# EAGLE design Music Shield v2.0 (EAGLE 6.2)
music shield

## Sheet 1 of 2
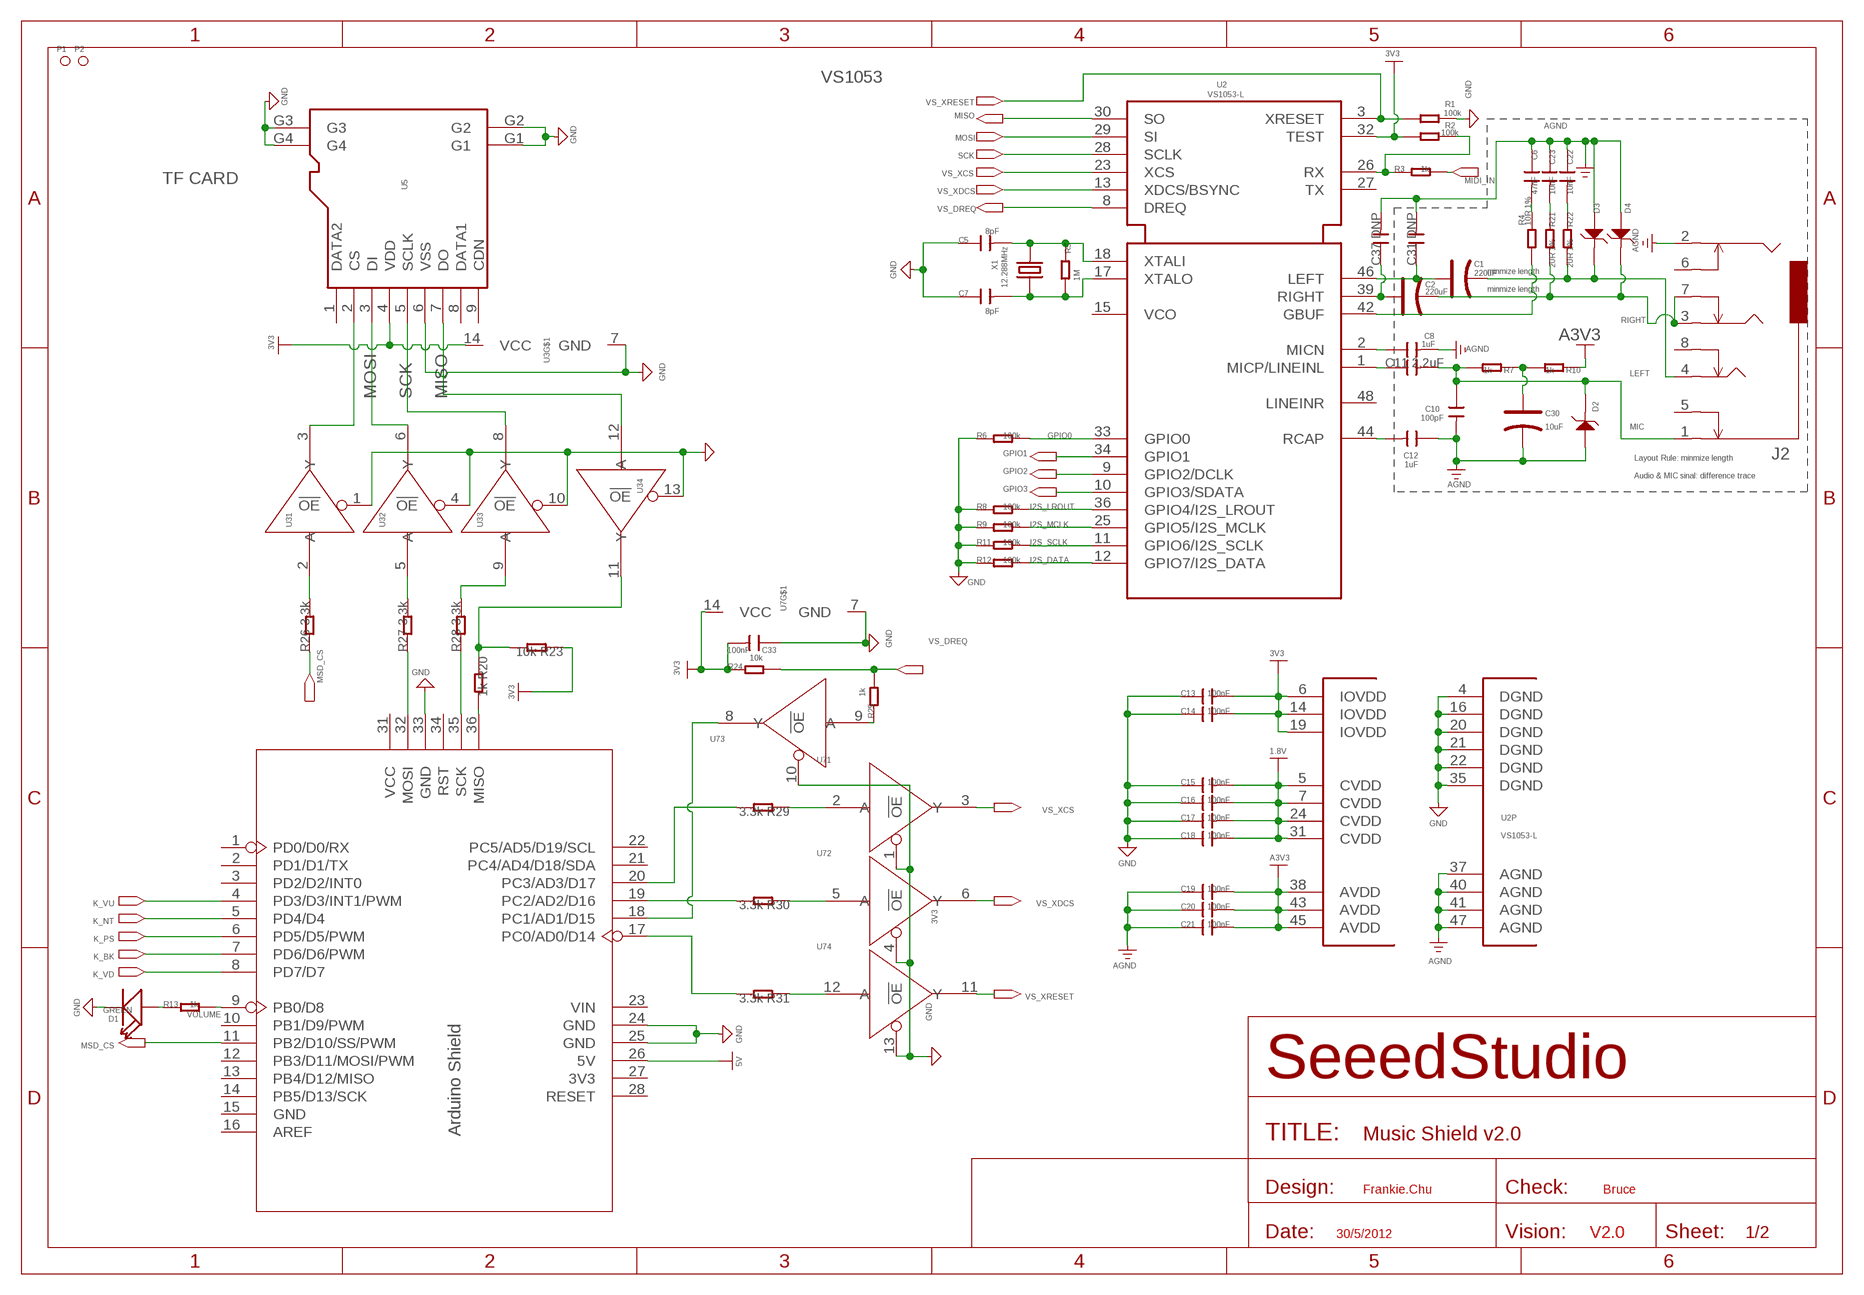
[diagram p0: schematic, sheet 1]

### Parts
C1  220uF  CAP-AVX-B  [AVX-B]
C2  220uF  CAP-AVX-B  [AVX-B]
C5  8pF  C-0603  [C0603]
C6  47nF  C-0603  [C0603]
C7  8pF  C-0603  [C0603]
C8  1uF  C-0603  [C0603]
C10  100pF  C-0603  [C0603]
C11  2.2uF  C-0805  [C0805]
C12  1uF  C-0603  [C0603]
C13  100nF  C-0603  [C0603]
C14  100nF  C-0603  [C0603]
C15  100nF  C-0603  [C0603]
C16  100nF  C-0603  [C0603]
C17  100nF  C-0603  [C0603]
C18  100nF  C-0603  [C0603]
C19  100nF  C-0603  [C0603]
C20  100nF  C-0603  [C0603]
C21  100nF  C-0603  [C0603]
C22  10nF  C-0603  [C0603]
C23  10nF  C-0603  [C0603]
C30  10uF  CAP-AVX-A  [AVX-A]
C31  DNP  C-0603  [C0603]
C33  100nF  C-0603  [C0603]
C37  DNP  C-0603  [C0603]
D1  GREEN  LED'0603'  [LED-0603]
D2  CESD5V0D1  D-ESD  [SOD123-2.7X1.6]
D3  CESD5V0D1  D-ESD  [SOD123-2.7X1.6]
D4  CESD5V0D1  D-ESD  [SOD123-2.7X1.6]
J2  AUDIO-8P'PJ-3536-L6S'  [8P-3.5-SMD]
P1  PAD-MARK  [ROUND-MARK-1.0]
P2  PAD-MARK  [ROUND-MARK-1.0]
R1  100k  R-0603  [R0603]
R2  100k  R-0603  [R0603]
R3  1k  R-0603  [R0603]
R4  10R 1%  R-0603  [R0603]
R5  1M  R-0603  [R0603]
R6  100k  R-0603  [R0603]
R7  1k  R-0603  [R0603]
R8  100k  R-0603  [R0603]
R9  100k  R-0603  [R0603]
R10  1k  R-0603  [R0603]
R11  100k  R-0603  [R0603]
R12  100k  R-0603  [R0603]
R13  1k  R-0603  [R0603]
R20  1k  R-0603  [R0603]
R21  20R 1%  R-0603  [R0603]
R22  20R 1%  R-0603  [R0603]
R23  10k  R-0603  [R0603]
R24  10k  R-0603  [R0603]
R25  1k  R-0603  [R0603]
R26  3.3k  R-0603  [R0603]
R27  3.3k  R-0603  [R0603]
R28  3.3k  R-0603  [R0603]
R29  3.3k  R-0603  [R0603]
R30  3.3k  R-0603  [R0603]
R31  3.3k  R-0603  [R0603]
U2  VS1053-L  [LQFP48]
U3  74VHC125PW  [TSSOP14]
U5  HOLDER-MICROSD-9P  [9P-SMD-W/-RING]
U7  74VHC125PW  [TSSOP14]
U9  ARDUINO  [ARDUINO]
X1  12.288MHz  CRYSTAL'5032'  [2P-SMD-5X3.2]

### Nets
1.8V: C15.2 C16.2 C17.2 C18.2 U2.5(CVDD) U2.7(CVDD) U2.24(CVDD) U2.31(CVDD) ; supply symbol labelled POWER_BAR ; also sheet 2
3V3: C13.2 C14.2 C33.2 R2.1 R23.1 R24.1 U2.6(IOVDD) U2.14(IOVDD) U2.19(IOVDD) U2.32(TEST) U3.14(VCC) U5.4(VDD) U7.14(VCC) ; supply symbol labelled POWER_BAR ; also sheet 2
5V: U9.26(5V) ; supply symbol labelled POWER_BAR ; also sheet 2
A3V3: C19.2 C20.2 C21.2 R10.1 U2.38(AVDD) U2.43(AVDD) U2.45(AVDD) ; supply symbol labelled POWER_BAR ; also sheet 2
AGND: C6.1 C8.2 C10.2 C12.1 C19.1 C20.1 C21.1 C22.1 C23.1 C30.- C31.2 C37.2 D2.1 D3.1 D4.1 J2.2 U2.37(AGND) U2.40(AGND) U2.41(AGND) U2.47(AGND) ; also sheet 2
GND: C5.1 C7.1 C13.1 C14.1 C15.1 C16.1 C17.1 C18.1 C33.1 D1.- R1.2 R6.1 R8.1 R9.1 R11.1 R12.1 U2.4(DGND) U2.16(DGND) U2.20(DGND) U2.21(DGND) U2.22(DGND) U2.35(DGND) U3.1(1:!OE) U3.4(2:!OE) U3.7(GND) U3.10(3:!OE) U3.13(4:!OE) U5.6(VSS) U5.G1 U5.G2 U5.G3 U5.G4 U7.1(1:!OE) U7.4(2:!OE) U7.7(GND) U7.10(3:!OE) U7.13(4:!OE) U9.24(GND) U9.25(GND) U9.33(GND) ; supply symbol labelled GND_SIGNAL ; also sheet 2
GPIO0: R6.2 U2.33(GPIO0)
GPIO1: U2.34(GPIO1) ; also sheet 2
GPIO2: U2.9(GPIO2/DCLK) ; also sheet 2
GPIO3: U2.10(GPIO3/SDATA) ; also sheet 2
I2S_DATA: R12.2 U2.12(GPIO7/I2S_DATA) ; also sheet 2
I2S_LROUT: R8.2 U2.36(GPIO4/I2S_LROUT) ; also sheet 2
I2S_MCLK: R9.2 U2.25(GPIO5/I2S_MCLK) ; also sheet 2
I2S_SCLK: R11.2 U2.11(GPIO6/I2S_SCLK) ; also sheet 2
K_BK: U9.7(PD6/D6/PWM) ; also sheet 2
K_NT: U9.5(PD4/D4) ; also sheet 2
K_PS: U9.6(PD5/D5/PWM) ; also sheet 2
K_VD: U9.8(PD7/D7) ; also sheet 2
K_VU: U9.4(PD3/D3/INT1/PWM) ; also sheet 2
LEFT: C1.- D3.2 J2.4 R22.2
MIC: C10.1 C11.2 D2.2 J2.1 R7.2
MIDI_IN: R3.2 ; also sheet 2
MISO: U2.30(SO) U3.12(4:A) U5.7(DO)
MOSI: U2.29(SI) U3.6(2:Y) U5.3(DI)
MSD_CS: R26.1 U9.11(PB2/D10/SS/PWM)
N$1: C5.2 R5.1 U2.18(XTALI) X1.2
N$2: C7.2 R5.2 U2.17(XTALO) X1.1
N$3: C12.2 U2.44(RCAP)
N$4: C30.+ R7.1 R10.2
N$5: C22.2 R22.1
N$6: C2.+ C37.1 U2.39(RIGHT)
N$7: C8.1 U2.2(MICN)
N$8: C1.+ C31.1 U2.46(LEFT)
N$9: C6.2 R4.2
N$10: C23.2 R21.1
N$11: C11.1 U2.1(MICP/LINEINL)
N$12: R2.2 R3.1 U2.26(RX)
N$14: R31.2 U9.17(PC0/AD0/D14)
N$15: R4.1 U2.42(GBUF)
N$16: R26.2 U3.2(1:A)
N$17: R29.1 U7.2(1:A)
N$18: R27.2 U3.5(2:A)
N$19: R30.1 U7.5(2:A)
N$20: R31.1 U7.12(4:A)
N$21: U3.3(1:Y) U5.2(CS)
N$22: R29.2 U9.20(PC3/AD3/D17)
N$23: R30.2 U9.19(PC2/AD2/D16)
N$24: U7.8(3:Y) U9.18(PC1/AD1/D15)
N$26: R27.1 U9.32(MOSI)
N$33: R28.1 U9.35(SCK)
N$36: R20.2 U9.36(MISO)
N$37: D1.+ R13.1
N$38: R25.1 U7.9(3:A)
N$39: R20.1 R23.2 U3.11(4:Y)
N$40: R28.2 U3.9(3:A)
RIGHT: C2.- D4.2 J2.3 J2.7 R21.2
SCK: U2.28(SCLK) U3.8(3:Y) U5.5(SCLK)
VOLUME: R13.2 U9.9(PB0/D8)
VS_DREQ: R24.2 R25.2 U2.8(DREQ)
VS_XCS: U2.23(XCS) U7.3(1:Y)
VS_XDCS: U2.13(XDCS/BSYNC) U7.6(2:Y)
VS_XRESET: R1.1 U2.3(XRESET) U7.11(4:Y)
Unconnected: J2.5 J2.6 J2.8 U2.15(VCO) U2.27(TX) U2.48(LINEINR) U5.1(DATA2) U5.8(DATA1) U5.9(CDN) U9.1(PD0/D0/RX) U9.2(PD1/D1/TX) U9.3(PD2/D2/INT0) U9.10(PB1/D9/PWM) U9.12(PB3/D11/MOSI/PWM) U9.13(PB4/D12/MISO) U9.14(PB5/D13/SCK) U9.15(GND) U9.16(AREF) U9.21(PC4/AD4/D18/SDA) U9.22(PC5/AD5/D19/SCL) U9.23(VIN) U9.27(3V3) U9.28(RESET) U9.31(VCC) U9.34(RST)

### Notes on the sheet
- VS1053
- TF CARD
- minmize length
- minmize length
- Layout Rule: minmize length
- Audio & MIC sinal: difference trace
- Arduino Shield
- Frankie.Chu | Bruce
- 30/5/2012 | V2.0

## Sheet 2 of 2
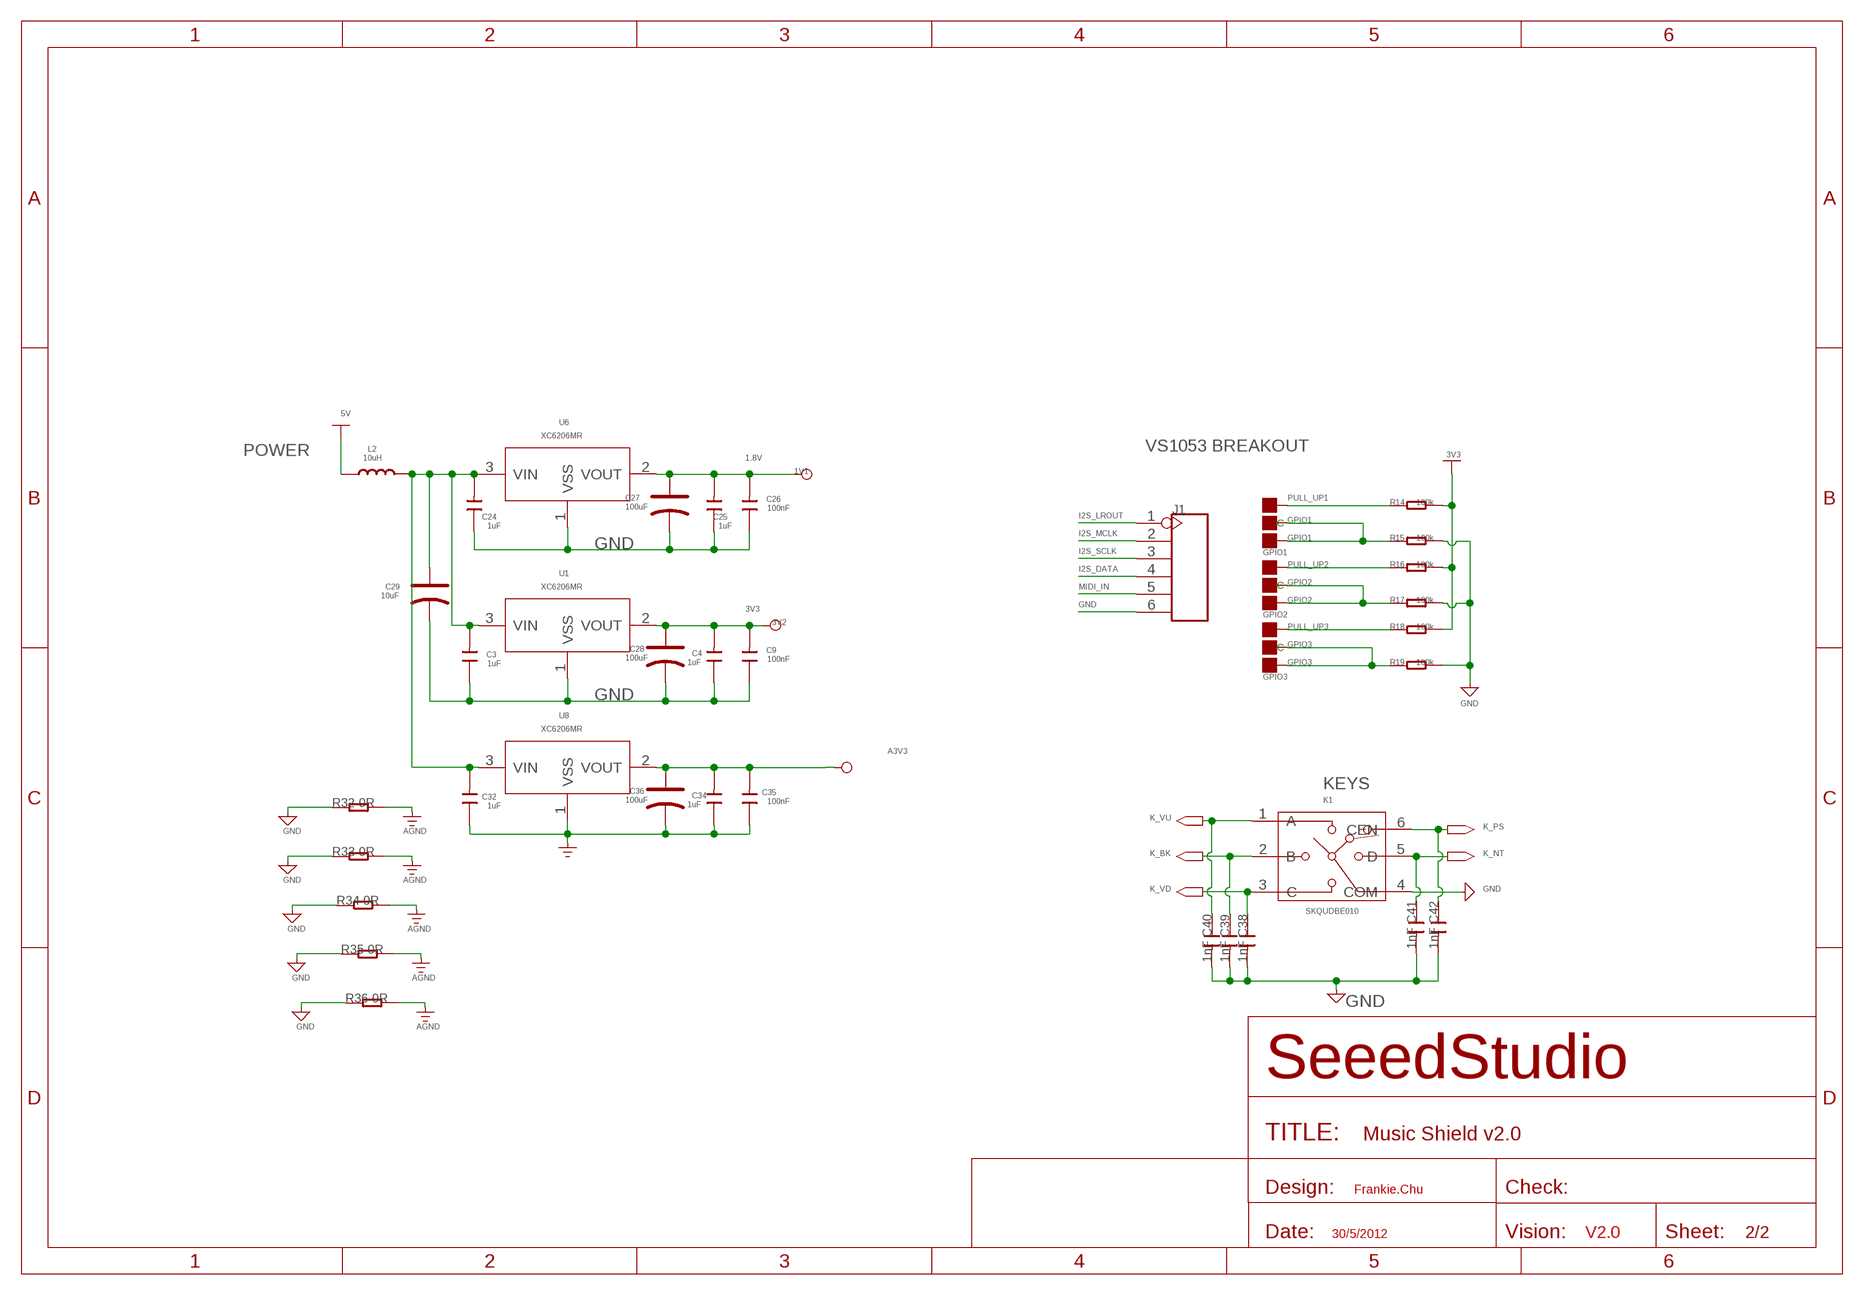
[diagram p1: schematic, sheet 2]

### Parts
1V1  TEST_POINT_SIZE_3030  [TP_3535]
3V2  TEST_POINT_SIZE_3030  [TP_3535]
A3V3  TEST_POINT_SIZE_3030  [TP_3535]
C3  1uF  C-0603  [C0603]
C4  1uF  C-0603  [C0603]
C9  100nF  C-0603  [C0603]
C24  1uF  C-0603  [C0603]
C25  1uF  C-0603  [C0603]
C26  100nF  C-0603  [C0603]
C27  100uF  CAP-AVX-B  [AVX-B]
C28  100uF  CAP-AVX-B  [AVX-B]
C29  10uF  CAP-AVX-A  [AVX-A]
C32  1uF  C-0603  [C0603]
C34  1uF  C-0603  [C0603]
C35  100nF  C-0603  [C0603]
C36  100uF  CAP-AVX-B  [AVX-B]
C38  1nF  C-0603  [C0603]
C39  1nF  C-0603  [C0603]
C40  1nF  C-0603  [C0603]
C41  1nF  C-0603  [C0603]
C42  1nF  C-0603  [C0603]
GPIO1  PAD-JUMPER-3P-40*40  [3P-SMD-4.1X1.5]
GPIO2  PAD-JUMPER-3P-40*40  [3P-SMD-4.1X1.5]
GPIO3  PAD-JUMPER-3P-40*40  [3P-SMD-4.1X1.5]
J1  HEADER-6P-55/35MIL  [6P-2.54-55/35MIL]
K1  SKQUDBE010  [6P-10X10X8.6MM]
L2  10uH  L'0806'  [0806]
R14  100k  R-0603  [R0603]
R15  100k  R-0603  [R0603]
R16  100k  R-0603  [R0603]
R17  100k  R-0603  [R0603]
R18  100k  R-0603  [R0603]
R19  100k  R-0603  [R0603]
R32  0R  R-0603  [R0603]
R33  0R  R-0603  [R0603]
R34  0R  R-0603  [R0603]
R35  0R  R-0603  [R0603]
R36  0R  R-0603  [R0603]
U1  XC6206MR  [SOT23]
U6  XC6206MR  [SOT23]
U8  XC6206MR  [SOT23]

### Nets
1.8V: 1V1.T C25.2 C26.2 C27.+ U6.2(VOUT) ; also sheet 1
3V3: 3V2.T C4.2 C9.2 C28.+ R14.2 R16.2 R18.2 U1.2(VOUT) ; supply symbol labelled POWER_BAR ; also sheet 1
5V: L2.1 ; supply symbol labelled POWER_BAR ; also sheet 1
A3V3: A3V3.T C34.2 C35.2 C36.+ U8.2(VOUT) ; also sheet 1
AGND: C32.1 C34.1 C35.1 C36.- R32.2 R33.2 R34.2 R35.2 R36.2 U8.1(VSS) ; also sheet 1
GND: C3.1 C4.1 C9.1 C24.1 C25.1 C26.1 C27.- C28.- C29.- C38.2 C39.2 C40.2 C41.2 C42.2 J1.6 K1.4(COM) R15.2 R17.2 R19.2 R32.1 R33.1 R34.1 R35.1 R36.1 U1.1(VSS) U6.1(VSS) ; supply symbol labelled GND_SIGNAL ; also sheet 1
GPIO1: GPIO1.00(L) GPIO1.MM(C) R15.1 ; also sheet 1
GPIO2: GPIO2.00(L) GPIO2.MM(C) R17.1 ; also sheet 1
GPIO3: GPIO3.00(L) GPIO3.MM(C) R19.1 ; also sheet 1
I2S_DATA: J1.4 ; also sheet 1
I2S_LROUT: J1.1 ; also sheet 1
I2S_MCLK: J1.2 ; also sheet 1
I2S_SCLK: J1.3 ; also sheet 1
K_BK: C39.1 K1.2(B) ; also sheet 1
K_NT: C41.1 K1.5(D) ; also sheet 1
K_PS: C42.1 K1.6(CEN) ; also sheet 1
K_VD: C38.1 K1.3(C) ; also sheet 1
K_VU: C40.1 K1.1(A) ; also sheet 1
MIDI_IN: J1.5 ; also sheet 1
N$13: C3.2 C24.2 C29.+ C32.2 L2.2 U1.3(VIN) U6.3(VIN) U8.3(VIN)
PULL_UP1: GPIO1.11(R) R14.1
PULL_UP2: GPIO2.11(R) R16.1
PULL_UP3: GPIO3.11(R) R18.1

### Notes on the sheet
- POWER | VS1053 BREAKOUT
- KEYS
- Frankie.Chu
- 30/5/2012 | V2.0

## Library data of the parts
1V1 3V2 A3V3 = For_Test_Albert:TEST_POINT
C1 C2 C27-C30 C36 = Discrete:CAP*: Electrolytic Capacitors,Tantalum Capacitors and Super Capacitors
C3-C26 C31-C35 C37-C42 = Discrete:C*: Ceramic Capacitors
D1 = Discrete:LED*
D2-D4 = template:D-ESD: Diodes for Protectiong against ESD
GPIO1-GPIO3 = Discrete:PAD-JUMPER-3P; PARTNO: DNP
J1 = Connector:HEADER-6P
J2 = template:AUDIO-8P
K1 = template:SKQUDBE010: four dircction and center button
L2 = Discrete:L*
P1 P2 = Discrete:PAD-MARK; PARTNO: DNP
R1-R36 = Discrete:R*
U1 U6 U8 = IC:XC6206: LOW ESR Cap.Compatible Positive Voltage Regulators
U2 = vlsi:VS1053
U3 U7 = template:74V*125: Quad Buffer/Line Driver;3-state
U5 = Connector:HOLDER-MICROSD-9P
U9 = moudle:ARDUINO
X1 = Discrete:CRYSTAL*: CRYSTAL

## Board
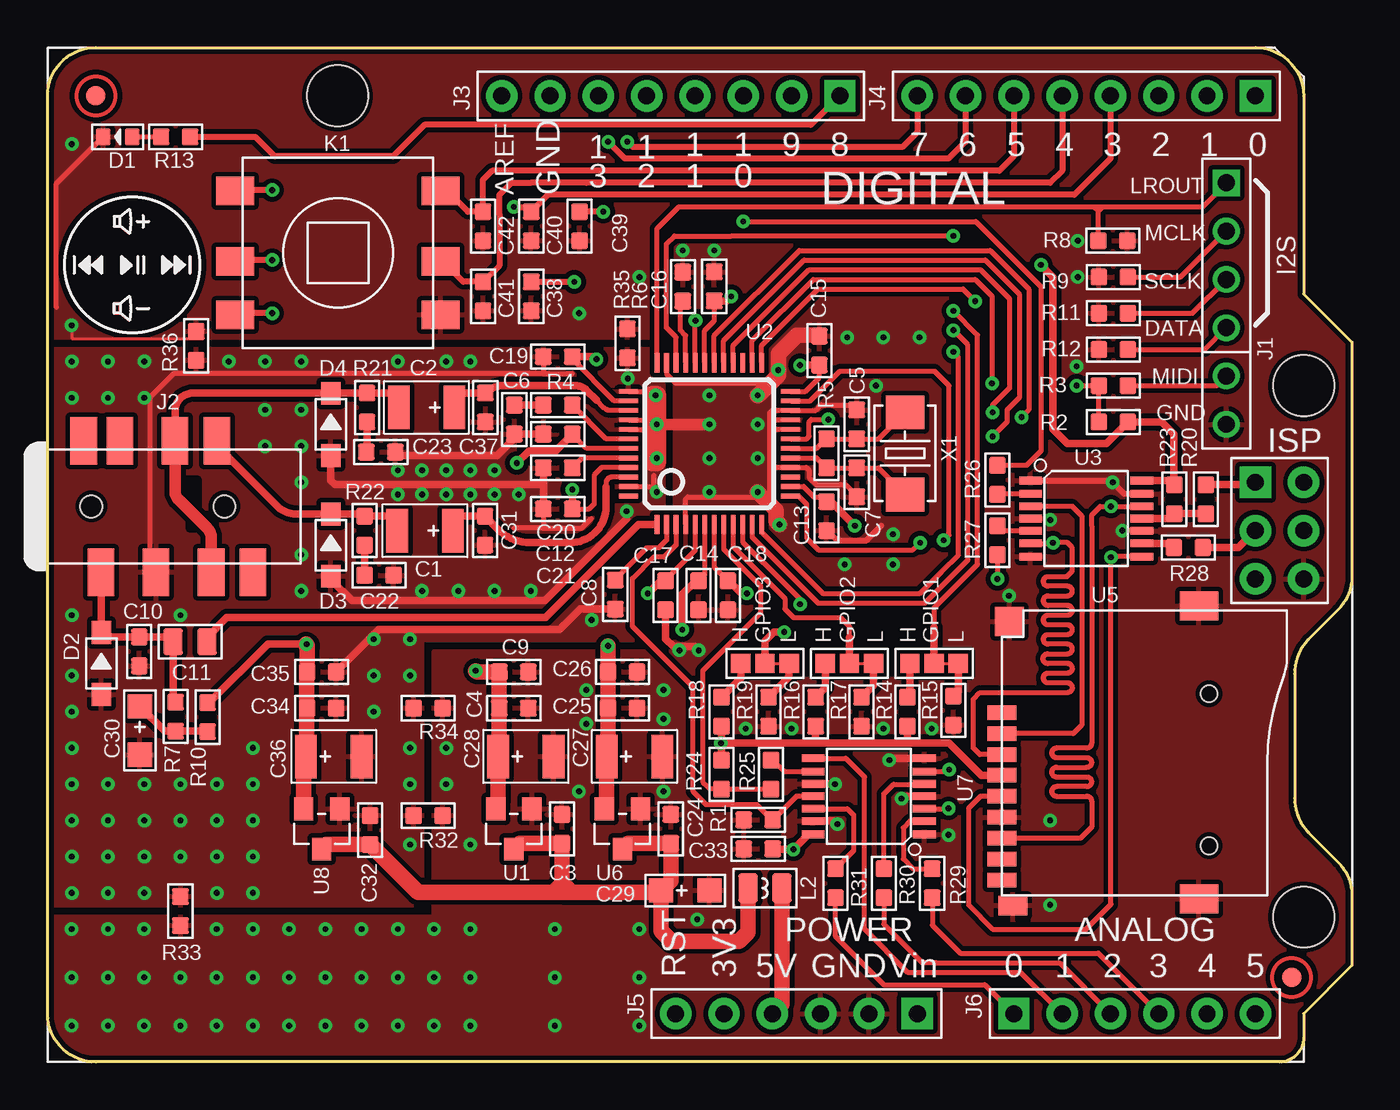
[diagram p2: board, top side]
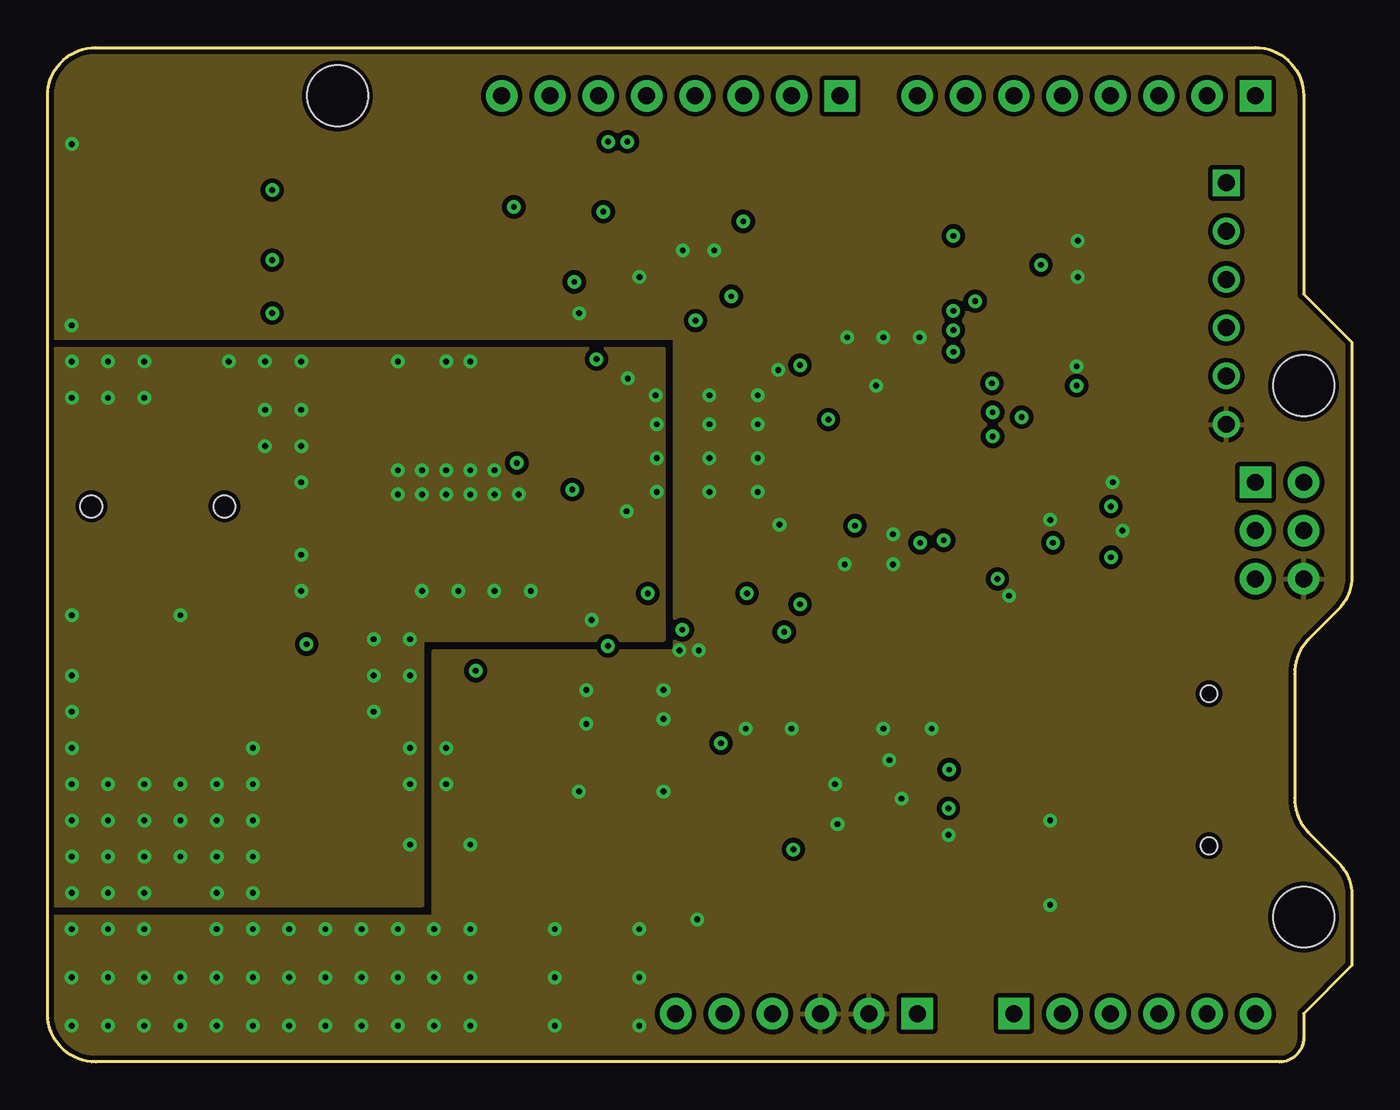
[diagram p3: board, inner layer GROUND]
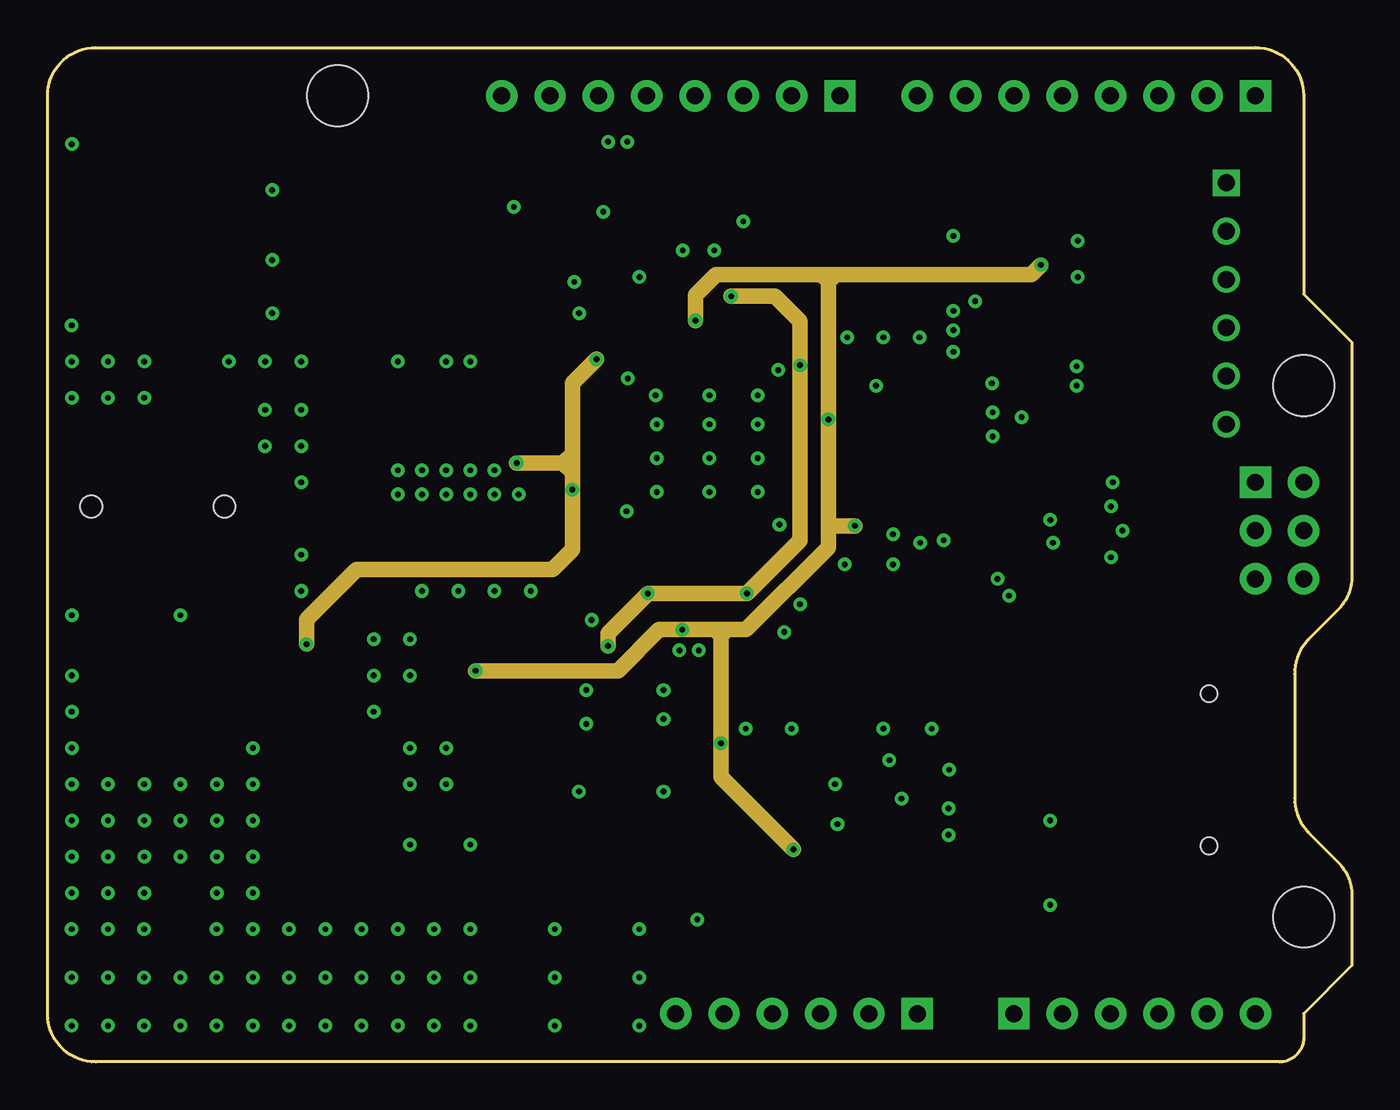
[diagram p4: board, inner layer SUPPLY]
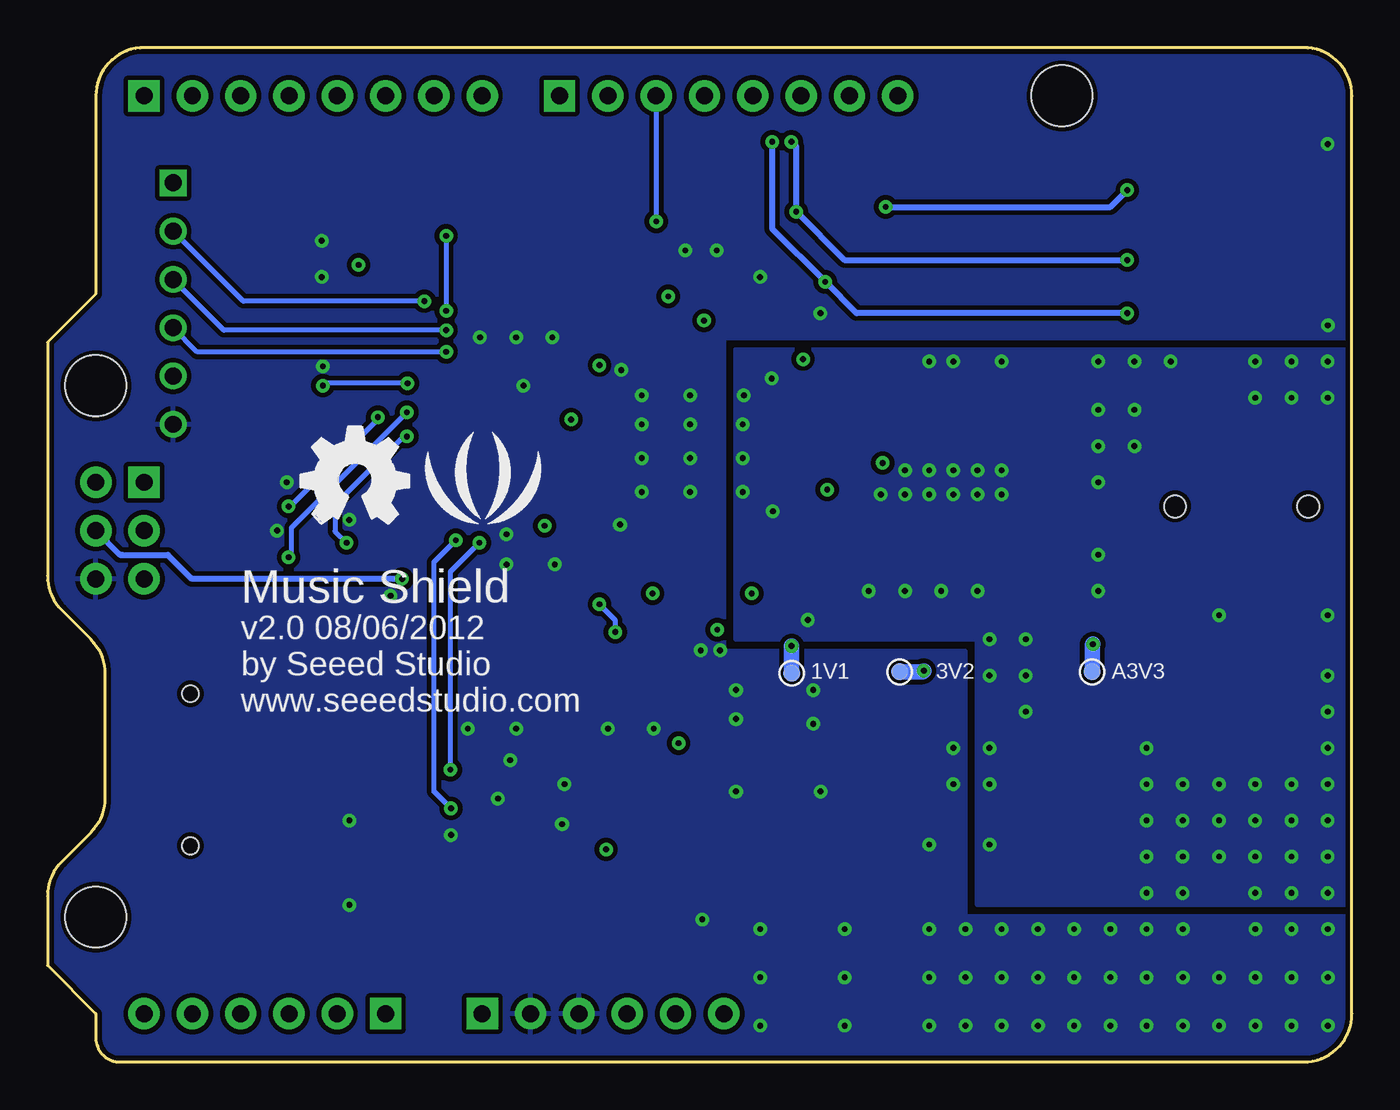
[diagram p5: board, bottom side, seen from below]

Size 68.58 x 53.34 mm. Coordinates in mm from the lower left corner, seen from the top.
Outline: 66.04,2.54 66.04,1.27 arc-90 64.77,0 2.54,0 arc-90 0,2.54 0,50.8 arc-90 2.54,53.34 63.5,53.34 arc-90 66.04,50.8 66.04,40.39 68.58,37.85 68.58,25.56 arc-45 67.84,23.77 66.3,22.2 arc45 65.56,20.42 65.56,13.87 arc45 66.3,12.09 67.84,10.52 arc-45 68.58,8.73 68.58,5.08 66.04,2.54
Copper layers (1*2+15*16): Top 0.035mm / dielectric 0.36mm / GROUND 0.035mm / dielectric 0.71mm / SUPPLY 0.035mm / dielectric 0.36mm / Bottom 0.035mm
Design rules: minimum track width 6mil, minimum drill 12mil, track to track 6mil, track to pad 8mil, pad to pad 8mil, via to via 8mil, smd to smd 0mil, copper to edge 8mil, drill to drill 8mil, minimum pad ring 10mil, minimum via ring 8mil, stop-mask expansion 4mil, vias tented up to drill 100mil, thermal gap 10mil
tRestrict: area 26.6,33.3 to 27.1,33.5; area 30.2,33.5 to 30.7,33.6; area 7.5,28.1 to 7.9,30.6; area 38.7,34 to 39.2,34.1; area 38.7,33.5 to 39.2,33.6

### Footprints (pad centres in the part's own frame; a part is rotated, then mirrored left to right if it is on the bottom)
TP_3535 = smd 0.889 x 0.889: T 0,0
AVX-B = smd 1.143 x 2.286: + -1.46,0; - 1.46,0
C0603 = smd 0.889 x 0.889: 1 -0.762,0; 2 0.762,0
C0805 = smd 1.016 x 1.397: 1 -0.889,0; 2 0.889,0
AVX-A = smd 1.27 x 1.27: + -1.27,0; - 1.27,0
LED-0603 = smd 0.762 x 0.889: + -0.762,0; - 0.762,0
SOD123-2.7X1.6 = smd 1.2 x 1.02: 1 -1.635,0; 2 1.635,0
3P-SMD-4.1X1.5 = smd 1.016 x 1.016: 00 -1.27,0; 11 1.27,0; MM 0,0
6P-2.54-55/35MIL = drill 0.889 pad 1.397 square: 1 0,6.35 | drill 0.889 pad 1.397: 2 0,3.81; 3 0,1.27; 4 0,-1.27; 5 0,-3.81; 6 0,-6.35
8P-3.5-SMD = smd 1.4 x 2.5: 1 2.8,-3.45; 2 5.7,-3.45; 3 8.6,-3.45; 4 8.9,3.45; 5 1.9,3.45; 6 3.8,3.45; 7 6.7,3.45; 8 10.8,-3.45 | hole 1.149: 2.3,0; 9.3,0
6P-10X10X8.6MM = smd 2 x 1.5: 1 -5.4,3.25; 2 -5.4,-0.45; 3 -5.4,-3.25; 4 5.4,-3.25; 5 5.4,-0.45; 6 5.4,3.25
0806 = smd 1.016 x 1.524: 1 -0.889,0; 2 0.889,0
ROUND-MARK-1.0 = smd 1.016 x 1.016: P$1 0,0
R0603 = smd 0.889 x 0.889: 1 -0.762,0; 2 0.762,0
SOT23 = smd 1.016 x 1.2: 1 -0.95,-1.06; 2 0.95,-1.06; 3 0,1.06
LQFP48 = smd 0.25 x 1: 1 -2.75,-4.25; 2 -2.25,-4.25; 3 -1.75,-4.25; 4 -1.25,-4.25; 5 -0.75,-4.25; 6 -0.25,-4.25; 7 0.25,-4.25; 8 0.75,-4.25; 9 1.25,-4.25; 10 1.75,-4.25; 11 2.25,-4.25; 12 2.75,-4.25; 25 2.75,4.25; 26 2.25,4.25; 27 1.75,4.25; 28 1.25,4.25; 29 0.75,4.25; 30 0.25,4.25; 31 -0.25,4.25; 32 -0.75,4.25; 33 -1.25,4.25; 34 -1.75,4.25; 35 -2.25,4.25; 36 -2.75,4.25 | smd 1 x 0.25: 13 4.25,-2.75; 14 4.25,-2.25; 15 4.25,-1.75; 16 4.25,-1.25; 17 4.25,-0.75; 18 4.25,-0.25; 19 4.25,0.25; 20 4.25,0.75; 21 4.25,1.25; 22 4.25,1.75; 23 4.25,2.25; 24 4.25,2.75; 37 -4.25,2.75; 38 -4.25,2.25; 39 -4.25,1.75; 40 -4.25,1.25; 41 -4.25,0.75; 42 -4.25,0.25; 43 -4.25,-0.25; 44 -4.25,-0.75; 45 -4.25,-1.25; 46 -4.25,-1.75; 47 -4.25,-2.25; 48 -4.25,-2.75
TSSOP14 = smd 0.4 x 1.2: 1 -2,-2.925; 2 -1.3,-2.925; 3 -0.65,-2.925; 4 0,-2.925; 5 0.65,-2.925; 6 1.3,-2.925; 7 2,-2.925; 8 2,2.925; 9 1.3,2.925; 10 0.65,2.925; 11 0,2.925; 12 -0.65,2.925; 13 -1.3,2.925; 14 -2,2.925
9P-SMD-W/-RING = smd 1.524 x 0.762: 1 0,4.4; 2 0,3.3; 3 0,2.2; 4 0,1.1; 5 0,0; 6 0,-1.1; 7 0,-2.2; 8 0,-3.3; 9 0,-4.4 | smd 1.524 x 1.016: G1 0.6,-5.746 | smd 2.032 x 1.524: G2 10.373,-5.4; G3 10.373,10 | smd 1.524 x 1.524: G4 0.392,9.181 | hole 0.889: 10.9,-2.6; 10.9,5.4
ARDUINO = drill 0.889 pad 1.651 square: 1 63.5,50.8; 9 41.656,50.8; 17 50.8,2.54; 23 45.72,2.54; 36 63.5,30.48 | drill 0.889 pad 1.651: 2 60.96,50.8; 3 58.42,50.8; 4 55.88,50.8; 5 53.34,50.8; 6 50.8,50.8; 7 48.26,50.8; 8 45.72,50.8; 10 39.116,50.8; 11 36.576,50.8; 12 34.036,50.8; 13 31.496,50.8; 14 28.956,50.8; 15 26.416,50.8; 16 23.876,50.8; 18 53.34,2.54; 19 55.88,2.54; 20 58.42,2.54; 21 60.96,2.54; 22 63.5,2.54; 24 43.18,2.54; 25 40.64,2.54; 26 38.1,2.54; 27 35.56,2.54; 28 33.02,2.54; 31 66.04,30.48; 32 66.04,27.94; 33 66.04,25.4; 34 63.5,25.4; 35 63.5,27.94 | hole 3.2: 15.24,50.8; 66.04,35.56; 66.04,7.62
2P-SMD-5X3.2 = smd 1.778 x 2.032: 1 -2.159,0; 2 2.159,0

### Placement (x,y rotation side)
1V1  29.46,20.45 0 bottom
3V2  23.78,20.51 0 bottom
A3V3  13.65,20.51 90 bottom
C1  19.84,27.94 180 top
C2  19.93,34.42 180 top
C3  27.05,12.26 270 top
C4  24.51,18.61 180 top
C5  42.55,33.53 270 top
C6  24.54,33.78 90 top
C7  42.55,30.48 90 top
C8  29.84,24.57 270 top
C9  24.51,20.51 180 top
C10  4.83,21.59 270 top
C11  7.49,22.1 180 top
C12  26.83,31.24 0 top
C13  40.96,28.7 90 top
C14  34.23,24.54 90 top
C15  40.58,37.4 270 top
C16  35.05,40.78 270 top
C17  32.49,24.54 90 top
C18  35.78,24.54 90 top
C19  26.83,37.08 0 top
C20  26.83,33.02 0 top
C21  26.83,29.08 0 top
C22  17.43,25.59 180 top
C23  17.52,32.07 180 top
C24  32.77,12.26 270 top
C25  30.23,18.61 180 top
C26  30.23,20.51 180 top
C27  30.86,16.07 0 top
C28  25.15,16.07 0 top
C29  33.53,9.02 0 top
C30  4.86,17.43 270 top
C31  23,27.94 270 top
C32  16.95,12.19 270 top
C33  37.37,11.21 0 top
C34  14.41,18.61 180 top
C35  14.41,20.51 180 top
C36  15.05,16.07 0 top
C37  23.02,34.42 270 top
C38  25.43,40.26 270 top
C39  27.97,43.94 270 top
C40  25.43,43.94 270 top
C41  22.89,40.26 270 top
C42  22.89,43.94 270 top
D1  3.68,48.64 180 top
D2  2.82,20.95 90 top
D3  14.89,27.18 90 top
D4  14.89,33.53 90 top
GPIO1  46.61,20.95 180 top
GPIO2  42.16,20.95 180 top
GPIO3  37.72,20.95 180 top
J1  61.98,39.88 0 top
J2  0,29.21 0 top
K1  15.27,42.55 0 top
L2  37.72,9.14 180 top
P1  2.54,50.8 0 top
P2  65.41,4.45 0 top
R1  37.37,12.73 180 top
R2  56.04,33.66 180 top
R3  56.04,35.56 0 top
R4  26.83,34.54 180 top
R5  40.96,32 270 top
R6  33.4,40.77 270 top
R7  6.73,18.16 90 top
R8  56.01,43.18 180 top
R9  56.04,41.27 0 top
R10  8.41,18.13 270 top
R11  56.04,39.37 0 top
R12  56.04,37.47 0 top
R13  6.73,48.64 0 top
R14  45.21,18.41 270 top
R15  47.62,18.48 270 top
R16  40.39,18.41 270 top
R17  42.8,18.41 270 top
R18  35.43,18.41 270 top
R19  37.91,18.41 270 top
R20  60.89,29.59 90 top
R21  16.79,34.42 90 top
R22  16.67,27.94 90 top
R23  59.24,29.59 270 top
R24  35.43,15.11 270 top
R25  38.03,15.11 270 top
R26  49.94,30.61 270 top
R27  49.94,27.43 90 top
R28  59.97,27.05 180 top
R29  46.51,9.4 270 top
R30  43.97,9.4 270 top
R31  41.43,9.4 270 top
R32  20.01,12.95 180 top
R33  6.99,7.94 90 top
R34  20.01,18.61 180 top
R35  30.48,37.78 270 top
R36  7.82,37.66 270 top
U1  24.51,12.26 180 top
U2  34.8,32.51 0 top
U3  54.61,28.57 270 top
U5  50.16,13.97 0 top
U6  30.23,12.26 180 top
U7  43.18,13.97 90 top
U8  14.41,12.26 180 top
U9  0,0 0 top
U$1  [LOGO_SILK]  45.69,29.97 0 bottom
U$2  [OSHW_FILLX200_NOTEXT]  55.25,28.32 0 bottom
X1  45.09,32 90 top

### Tracks (layer width: path | path; a pad name or v marks a point on that pad's centre or on a via)
1.8V  (via drill 0.3 pad 0.64)
  Top 0.254: U2.24 39.84,35.26 40.58,35.99 C15.2 | 32.67,25.4 32.57,25.3 C17.2 32.54,25.35 32.54,25.4 34.05,26.91 U2.5 | U2.7 35.05,26.03 C18.2 | U2.31 34.55,38.45 35.05,38.96 C16.2
  Top 0.406: v39.56,36.64 C15.2 | v31.56,24.64 32.22,25.3 C17.2 | v36.77,24.64 36.48,24.64 35.82,25.3 C18.2 | C16.2 35.7,40.02 v35.94,40.26
  Top 0.813: v29.46,21.87 C26.2 C25.2 29.46,16.13 C27.+ 29.4,13.44 U6.2
  SUPPLY 0.813: v29.46,21.87 29.46,22.54 v31.56,24.64 v36.77,24.64 39.56,27.43 v39.56,36.64 39.56,38.96 38.26,40.26 v35.94,40.26
  Bottom 0.813: v29.46,21.87 29.46,20.48 | 29.46,20.48 29.49,20.45 | 1V1.T 29.46,20.48
3V3  (via drill 0.3 pad 0.64)
  Top 0.254: U2.14 39.74,30.26 40.29,29.72 40.7,29.72 C13.2 | U2.32 34.05,38.97 v34.07,38.99 | U2.19 39.9,32.76 40.03,32.89 40.03,33.66 40.16,33.78 v41.05,33.78 | U2.6 34.55,25.62 C14.2
  Top 0.305: 40.39,16.79 40.39,17.02 | 40.39,17.02 40.39,17.08 40.39,17.02 | 40.39,17.02 40.14,16.76 | 40.39,17.02 | 40.39,17.02 40.64,16.76
  Top 0.406: C14.2 34.09,25.3 33.37,24.57 v33.37,22.73 | 38.29,11.21 C33.2 38.16,11.18 v39.21,11.18 40,11.97 U7.14 | R18.2 35.43,16.89 | 35.43,16.8 R24.1 | C13.2 41.18,29.46 v42.45,28.19 | U3.14 58.99,30.57 59.21,30.35 | R23.1 59.21,30.35 | 59.21,30.35 59.21,33.02 58.58,33.66 R2.1 55.66,32.51 53.62,32.51 52.86,33.27 52.86,41.27 v52.23,41.91 | 45.24,16.76 45.03,16.76 | 45.03,16.76 40.64,16.76 40.42,16.76 | 40.42,16.76 40.14,16.76 35.56,16.76 35.43,16.89 | R16.2 40.39,17.08 40.39,16.79 40.42,16.76 | U5.4 49.09,15.07 47.4,16.76 45.41,16.76 | 45.41,16.76 45.24,16.76 | R14.2 45.21,17.14 | 45.24,16.76 45.21,16.79 45.21,17.08 | 35.43,16.89 35.43,16.8 | 35.43,16.8 v35.4,16.76 | 45.21,17.08 45.21,17.14 | 45.21,17.14 45.22,17.14 45.22,17.08 | 45.22,16.95 45.03,16.76 | 45.21,17.08 45.22,17.08 | 45.22,17.08 45.22,16.95 | 45.22,16.95 45.41,16.76
  Top 0.813: U1.2 23.56,13.43 23.52,13.46 23.69,13.62 C28.+ 23.75,16.13 C4.2 23.75,20.29 23.78,20.32 3V2.T C9.2 22.57,20.51 v22.51,20.57
  SUPPLY 0.813: v22.51,20.57 30,20.57 32.16,22.73 v33.37,22.73 35.08,22.73 | 35.08,22.73 35.46,22.73 | 35.46,22.73 35.72,22.73 | 35.72,22.73 36.73,22.73 41.05,27.05 41.05,28.45 | 41.05,28.45 v41.05,33.78 41.05,41.4 | v34.07,38.99 34.07,40.32 35.15,41.4 40.67,41.4 | v42.45,28.19 41.3,28.19 41.05,28.45 | 40.67,41.4 41.05,41.4 | 41.05,41.4 41.43,41.4 | 41.43,41.4 51.72,41.4 v52.23,41.91 | 35.46,22.73 35.4,22.67 v35.4,16.76 35.4,14.99 v39.21,11.18 | 40.67,41.4 41.05,41.02 41.43,41.4 | 35.08,22.73 35.4,22.42 35.72,22.73
  Bottom 0.813: 3V2.T 22.57,20.51 v22.51,20.57
5V
  Top 0.813: L2.1 38.61,3.04 U9.26
A3V3  (via drill 0.3 pad 0.64)
  Top 0.254: U2.38 29.78,34.76 27.59,36.96 C19.2 | U2.43 28.35,32.26 C20.2 | U2.45 29.13,31.26 28.73,30.86 28.73,29.34 28.48,29.08 C21.2
  Top 0.406: C20.2 26.7,32.13 25.3,32.13 v24.67,31.5 | C21.2 v27.59,30.1 | R10.1 8.51,18.89 11.59,21.97 13.59,21.97 v13.62,21.97 | C19.2 28.64,37.08 28.77,36.96 v28.86,36.96
  Top 0.813: U8.2 13.46,15.88 | 13.46,15.88 13.46,15.97 13.62,16.13 13.62,18.57 | C36.+ 13.59,16 13.46,15.88 | 13.62,18.57 C34.2 | 13.62,18.57 13.62,20.57 13.65,20.54 C35.2 13.65,21.81 | 13.65,21.81 13.65,21.91 13.59,21.97 13.59,21.87 13.65,21.81
  SUPPLY 0.813: 27.59,30.99 v27.59,30.1 27.59,26.95 27.44,26.8 26.55,25.91 16.26,25.91 13.62,23.27 v13.62,21.97 | 27.59,30.99 27.59,31.62 | 27.59,31.62 27.59,32 | v24.67,31.5 27.08,31.5 | 27.08,31.5 27.46,31.5 27.59,31.62 | 27.08,31.5 27.59,32 | 27.08,31.5 27.59,30.99 | 27.59,32 27.59,35.69 v28.86,36.96
  Bottom 0.813: C35.2 13.65,21.94 v13.62,21.97
AGND  (via drill 0.3 pad 0.64)
  Top 0.254: C19.1 26.06,36.2 | 26.06,36.2 27.59,36.2 | 26.06,36.2 6.63,36.2 5.36,34.92 5.36,26.1 J2.2 | U2.37 31.88,35.26 31.88,34.8 | U2.47 31.88,30.26 31.88,30.86 | U2.40 32.01,33.76 32.01,33.53 v32.03,33.53 32.03,33.26 U2.41 | C21.1 26.06,28.09 26.04,28.07 | 26.04,28.07 28.07,28.07 28.58,28.57 | 26.04,28.07 24.52,28.07
  Top 0.406: C20.1 24.77,33.02 | 24.77,33.02 C6.1 24.52,33.02 24.52,32.77 | C12.1 26.06,30.35 | 26.06,30.35 C21.1 | 18.35,31.88 23.63,31.88 24.77,33.02 | 18.16,30.36 18.17,30.35 | 18.17,30.35 15.12,30.35 14.89,30.58 D4.1 | 18.17,30.35 26.06,30.35 | 18.3,25.7 C22.1 | D3.1 14.89,25.38 16.01,24.26 26.17,24.26 30.45,28.54 v30.45,28.96 | C8.2 28.01,23.81 26.93,22.73 17.4,22.73 C35.1
  Top 1.016: v31.97,35.05 32.01,35.05 32.01,33.53 32.01,31.56 | 31.82,35.05 31.82,31.56
  other vias: 32.03,31.75 32.03,29.97 30.51,35.94 1.27,36.83 28.61,23.24 3.18,36.83 1.27,34.92 3.18,34.92 5.08,34.92 5.08,36.83 18.42,31.11 22.23,31.11 23.5,29.84 22.23,29.84 18.42,29.84 13.34,30.48 13.34,32.38 13.34,34.29 11.43,34.29 11.43,32.38 24.77,29.84 23.5,24.77 21.59,24.77 19.69,24.77 13.34,26.67 13.34,24.77 25.4,24.77 1.27,23.5 1.27,20.32 1.27,18.41 1.27,16.51 1.27,14.61 1.27,12.7 5.08,12.7 6.99,12.7 8.89,12.7 10.8,12.7 6.99,14.61 10.8,14.61 10.8,16.51 6.99,23.5 17.15,22.23 19.05,22.23 19.05,20.32 19.05,16.51 19.05,14.61 19.05,11.43 10.8,10.79 8.89,10.79 6.99,10.79 5.08,10.79 3.18,10.79 1.27,10.79 1.27,8.89 3.18,8.89 5.08,8.89 8.89,8.89 10.8,8.89 3.18,12.7 5.08,14.61 3.18,14.61 8.89,14.61 23.5,31.11 17.15,20.32 17.15,18.41 9.53,36.83 11.43,36.83 13.34,36.83 18.42,36.83 20.96,36.83 22.23,36.83 19.69,29.84 19.69,31.11 20.96,31.11 20.96,29.84
  pour Top: -17.68,46.99 -14.5,46.99 -14.5,43.05 -17.68,43.05
  pour Top (isolate 0.254): 0,8.26 19.69,8.26 19.69,22.23 32.39,22.23 32.39,37.47 0,37.47
  pour Bottom (isolate 0.254): 0,8.26 19.69,8.26 19.69,22.23 32.39,22.23 32.39,37.47 0,37.47
  pour GROUND (isolate 0.254): 0,8.26 19.69,8.26 19.69,22.23 32.39,22.23 32.39,37.47 0,37.47
GND  (via drill 0.3 pad 0.64)
  Top 0.152: v1.27,38.73 1.27,38.05 8.18,38.05 8.18,38.53
  Top 0.203: v1.27,38.73
  Top 0.254: 42.55,34.26 42.57,34.29 42.32,34.54 40.67,34.54 40.39,34.26 U2.22 38.08,34.26 37.98,34.16 37.98,33.78 | 42.57,29.72 41.94,30.35 40.42,30.35 40.03,30.73 40.03,31.11 39.89,31.26 U2.16 38,31.26 37.98,31.24 | U2.35 32.55,36.16 33.02,35.69 37.98,35.69 38.11,35.81 | U2.4 33.55,29.61 33.66,29.72 37.98,29.72 37.98,31.24 | 37.98,31.24 37.98,33.27 | 37.98,33.27 37.98,33.78 | U2.21 38,33.76 37.98,33.78 | U2.20 37.99,33.26 37.98,33.27 | U3.10 57.3,27.93 57.28,27.94 v56.51,27.94 | 0.47,39.67 0.47,46.19 D1.-
  Top 0.305: C13.1 41.03,27.94 41.53,27.43 43.06,27.43 43.82,28.19 | U3.1 55.91,30.57 v56.01,30.48 56.61,29.88 U3.13
  Top 0.406: U7.10 41.39,14.62 v41.4,14.61 | U7.7 44.35,15.97 v44.26,15.88 | U7.4 44.99,13.97 44.86,13.84 | U7.13 41.4,12.67 41.56,12.51 | C17.1 32.49,22.25 32.9,21.84 34.04,21.84 34.29,21.59
  Top 0.61: v34.8,33.53 32.14,33.53 32.01,33.53
  Top 0.813: v38.48,28.26 38.29,28.45 38.29,29.02 v37.34,29.97 | v37.34,35.05 38.11,35.81 38.42,36.12 38.42,37.24 39.4,38.23 | 39.5,38.23 40.51,38.23 C15.1
  other vias: 43.94,38.1 45.85,38.1 43.56,35.56 44.45,27.75 33.4,42.67 35.05,42.67 44.89,13.84 47.37,11.94 54.17,41.27 54.1,36.58 41.53,12.51 34.24,21.64 34.8,35.05 38.42,36.39 42.04,38.1 39.12,17.53 43.94,17.53 46.48,17.53 36.7,17.53 44.45,26.16 41.91,26.16 37.34,33.53 37.34,31.75 34.8,29.97 28.32,19.56 32.38,19.56 28.32,17.78 32.38,18.03 27.94,14.22 32.38,14.22 52.71,8.26 52.71,12.7 50.55,24.51 34.16,7.49 22.22,11.43 33.22,21.64 20.95,16.51 20.95,14.61 1.27,6.99 3.17,6.99 5.08,6.99 8.89,6.99 10.8,6.99 1.27,1.91 3.17,1.91 5.08,1.91 6.99,1.91 8.89,1.91 10.8,1.91 10.8,4.45 8.89,4.45 6.99,4.45 5.08,4.45 3.17,4.45 1.27,4.45 12.7,6.99 14.61,6.99 16.51,6.99 18.41,6.99 20.32,6.99 22.22,6.99 12.7,4.45 14.61,4.45 16.51,4.45 18.41,4.45 20.32,4.45 22.22,4.45 22.22,1.91 20.32,1.91 18.41,1.91 16.51,1.91 14.61,1.91 12.7,1.91 31.11,6.99 26.67,6.99 26.67,4.45 26.67,1.91 31.11,1.91 31.11,4.45 1.27,48.26 27.94,39.37 31.12,41.27 54.17,43.18 52.72,28.5 34.8,31.75
  pour Bottom (isolate 0.254): -11.33,46.99 -8.03,46.99 -8.03,43.05 -11.33,43.05
  pour Top (isolate 0.254): 0,7.62 20.32,7.62 20.32,21.59 33.02,21.59 33.02,38.1 0,38.1 0,53.34 68.58,53.34 68.58,0 0,0
  pour Bottom (isolate 0.254): 0,7.62 20.32,7.62 20.32,21.59 33.02,21.59 33.02,38.1 0,38.1 0,53.34 68.58,53.34 68.58,0 0,0
  pour GROUND (isolate 0.254): 0,7.62 20.32,7.62 20.32,21.59 33.02,21.59 33.02,38.1 0,38.1 0,53.34 68.58,53.34 68.58,0 0,0
GPIO0
  Top 0.254: U2.33 33.55,38.21 33.27,38.48 33.27,39.98 33.3,40.01 R6.2
GPIO1  (via drill 0.3 pad 0.64)
  Top 0.152: GPIO1.MM GPIO1.00
  Top 0.254: v47.62,39.5 48.89,38.23 48.89,26.16 46.61,23.88 46.61,22.86 | U2.34 33.05,38.1 32.54,38.61 32.54,42.67 32.54,43.02 32.96,43.43 35.97,43.43 v47.62,43.43 | v47.62,43.43 47.65,43.43 v47.62,43.43
  Top 0.406: GPIO1.MM 46.61,22.86 | GPIO1.00 47.88,19.49 R15.1
  Bottom 0.254: v47.62,43.43 v47.62,39.5
GPIO2
  Top 0.152: GPIO2.MM GPIO2.00
  Top 0.254: U2.9 36.05,27.12 36.05,27.1 38.76,24.38 38.76,23.83 39.22,23.37 41.69,23.37 41.88,23.18 | 41.88,23.18 42.07,22.99 | 42.16,22.32 42.16,22.89 41.88,23.18
  Top 0.406: GPIO2.MM 42.16,22.32 | GPIO2.00 43.43,19.81 R17.1
GPIO3  (via drill 0.3 pad 0.64)
  Top 0.152: GPIO3.MM GPIO3.00
  Top 0.254: U2.10 36.55,27.35 38.73,25.17 38.74,25.17 39.56,24.35 v39.56,24.07
  Top 0.406: GPIO3.MM 37.72,22.14 38.18,22.61 v38.73,22.61 | GPIO3.00 38.99,20.26 R19.1
  Bottom 0.254: v39.56,24.07 38.73,23.24 v38.73,22.61
I2S_DATA  (via drill 0.3 pad 0.64)
  Top 0.254: U2.12 37.55,27.86 39.12,26.29 40.77,24.64 45.88,24.64 47.02,25.78 47.88,26.64 47.88,26.67 47.88,37.08 v47.62,37.34 | R12.2 60.83,37.47 J1.4
  Bottom 0.254: v47.62,37.34 60.71,37.34 J1.4
I2S_LROUT
  Top 0.254: U2.36 32.05,43.8 32.03,43.81 33.18,44.96 54.51,44.96 55.02,44.96 | J1.1 60.71,44.96 55.47,44.96 | 55.47,44.96 55.15,44.96 | 55.15,44.96 55.02,44.96 | R8.2 55.24,44.48 | 55.24,44.48 55.24,44.86 55.15,44.96 | 55.24,44.48 55.24,44.73 55.02,44.96 | 55.24,44.48 55.24,44.74 55.47,44.96
I2S_MCLK  (via drill 0.3 pad 0.64)
  Top 0.254: U2.25 37.55,37.67 40.51,40.64 48.13,40.64 v48.77,40.01 | R9.2 59.56,41.27 J1.2
  Bottom 0.254: v48.77,40.01 58.29,40.01 J1.2
I2S_SCLK  (via drill 0.3 pad 0.64)
  Top 0.254: U2.11 37.05,27.59 38.86,25.78 40.51,24.13 46.13,24.13 47.02,25.02 48.39,26.39 48.39,26.42 48.39,37.72 v47.62,38.48 | R11.2 60.2,39.37 J1.3
  Bottom 0.254: v47.62,38.48 59.31,38.48 J1.3
K_BK  (via drill 0.3 pad 0.64)
  Top 0.305: U9.7 48.26,48.39 47.38,47.5 30.36,47.5 v29.47,48.39 | v29.21,44.7 C39.1 | v11.82,42.16 9.87,42.16 K1.2
  Bottom 0.305: v11.82,42.16 26.67,42.16 v29.21,44.7 29.21,48.13 v29.47,48.39
K_NT
  Top 0.305: U9.5 53.34,46.86 52.71,46.23 28.33,46.23 25.4,46.23 24.39,46.23 23.75,45.59 23.75,44.58 23.75,41.88 C41.1 21.85,41.02 21.21,41.66 20.77,42.09 K1.5
K_PS
  Top 0.305: U9.6 50.8,47.62 50.04,46.86 23.37,46.86 22.89,46.38 C42.1 22.1,44.7 21.34,45.47 21.01,45.8 K1.6
K_VD  (via drill 0.3 pad 0.64)
  Top 0.305: U9.8 45.72,48.9 44.94,48.11 30.76,48.11 v30.48,48.39 | C38.1 v27.69,41.02 | v11.82,39.37 9.87,39.37 K1.3
  Bottom 0.305: v30.48,48.39 30.48,43.81 v27.69,41.02 26.04,39.37 v11.82,39.37
K_VU  (via drill 0.3 pad 0.64)
  Top 0.305: U9.4 55.88,47.5 53.98,45.59 26.32,45.59 C40.1 25.4,44.7 25.15,44.96 v24.52,44.96 | 10.16,45.85 10.17,45.84 9.87,45.84 K1.1 9.87,45.85 v11.82,45.85
  Bottom 0.305: v11.82,45.85 12.7,44.96 v24.52,44.96
LEFT
  Top 0.406: J2.4 8.9,32.41 12.1,29.2 arc45 13.05,28.81 D3.2 16.56,28.81 R22.2 18.17,28.7 18.38,28.49 C1.-
MIC
  Top 0.406: R7.2 6.6,19.05 C11.2 6.35,22.35 C10.1 3.06,22.35 D2.2 2.82,25.78 J2.1
MIDI_IN
  Top 0.254: R3.2 61.47,35.56 J1.5
MISO  (via drill 0.3 pad 0.64)
  Top 0.254: U2.30 35.05,38.19 39.53,42.67 49.56,42.67 51.59,40.64 51.59,34.29 v51.21,33.91 | U3.12 57.52,29.21 v55.91,29.21 55.35,29.21 54.89,28.75 54.89,28.19 54.89,16.76 arc-90 54.64,16.51 53.05,16.51 arc90 52.8,16.26 arc90 53.05,16 54.64,16 arc-90 54.89,15.75 arc-90 54.64,15.49 53.05,15.49 arc90 52.8,15.24 arc90 53.05,14.99 54.64,14.99 arc-90 54.89,14.73 arc-90 54.64,14.48 53.05,14.48 arc90 52.8,14.22 arc90 53.05,13.97 54.64,13.97 arc-90 54.89,13.72 54.89,12.36 54.31,11.77 U5.7
  Bottom 0.254: v51.21,33.91 51.21,33.81 55.81,29.21 v55.91,29.21
MOSI  (via drill 0.3 pad 0.64)
  Top 0.254: U2.29 35.55,37.93 39.78,42.16 49.31,42.16 51.08,40.39 51.08,34.92 50.45,34.29 50.45,33.66 v49.69,32.89 | U3.6 52.83,27.27 v52.86,27.3 53.62,27.3 53.88,27.05 53.88,25.81 53.59,25.53 52.61,25.53 arc90 52.35,25.27 arc90 52.61,25.02 53.62,25.02 arc-90 53.88,24.77 arc-90 53.62,24.51 52.61,24.51 arc90 52.35,24.26 arc90 52.61,24 53.62,24 arc-90 53.88,23.75 arc-90 53.62,23.5 52.61,23.5 arc90 52.35,23.24 arc90 52.61,22.99 53.62,22.99 arc-90 53.88,22.73 arc-90 53.62,22.48 52.61,22.48 arc90 52.35,22.23 arc90 52.61,21.97 53.62,21.97 arc-90 53.88,21.72 arc-90 53.62,21.46 52.59,21.46 arc45 52.41,21.39 arc90 52.41,21.03 arc45 52.59,20.95 53.62,20.95 arc-90 53.88,20.7 arc-90 53.62,20.45 52.61,20.45 arc90 52.35,20.19 arc90 52.61,19.94 53.62,19.94 arc-90 53.88,19.68 arc-90 53.62,19.43 49.03,19.43 48.67,19.07 48.67,16.51 49.01,16.17 U5.3
  Bottom 0.254: v49.69,32.89 49.87,32.89 53.46,29.3 53.46,27.9 v52.86,27.3 52.84,27.3
MSD_CS  (via drill 0.3 pad 0.64)
  Top 0.254: v36.58,44.2 48.8,44.2 52.23,40.77 52.23,34.54 52.23,32.13 51.46,31.37 R26.1
  Bottom 0.254: v36.58,44.2 U9.11
N$1
  Top 0.254: X1.2 43.69,32.77 C5.2 R5.1 40.92,32.77 40.42,32.26 U2.18
N$2
  Top 0.254: X1.1 43.69,31.24 C7.2 R5.2 40.44,31.76 U2.17
N$3
  Top 0.254: U2.44 28.11,31.76 27.72,31.37 C12.2
N$4
  Top 0.406: R10.2 8.38,17.4 R7.1 6.16,17.4 C30.+
N$5
  Top 0.406: C22.2 R22.1
N$6
  Top 0.254: U2.39 29.58,34.26 arc-45 29.26,34.4 28.86,34.8
  Top 0.406: 28.86,34.8 28.32,35.33 arc45 27.77,35.56 23.94,35.56 arc45 C37.1 21.72,35.18 21.39,34.84 C2.+
N$7
  Top 0.254: U2.2 32.55,27.44 32.16,27.05 31.53,27.05 29.84,25.37 C8.1 29.84,25.3
N$8
  Top 0.254: U2.46 29.69,30.76 arc90 29.37,30.44 29.37,30.23
  Top 0.406: 29.37,29.19 29.37,29.21 | 29.37,29.21 29.37,30.23 | 29.37,29.21 arc-90 27.46,27.3 25.38,27.3 arc-45 23.69,28.01 C31.1 | C31.1 21.72,28.7 21.3,28.28 C1.+ | C31.1
N$9
  Top 0.406: C6.2 R4.2
N$10
  Top 0.406: R21.1 16.79,32.09 C23.2
N$11
  Top 0.254: U2.1 31.53,28.26
  Top 0.406: 31.97,28.26 31.53,28.26 31.08,28.26 26.19,23.37 9.43,23.37 8.38,22.32 C11.1
N$12  (via drill 0.3 pad 0.64)
  Top 0.254: U2.26 37.05,37.94 40.26,41.15 48.77,41.15 49.66,40.26 v49.66,35.69 | R2.2 R3.1 v54.1,35.56
  Bottom 0.254: v49.66,35.69 54,35.69 54.13,35.56 v54.1,35.56
N$13
  Top 0.813: L2.2 36.83,6.83 36.35,6.35 32.8,6.35 32.26,6.89 C29.+ | C29.+ 32.77,9.53 C24.2 30.52,11.49 U6.3 | U1.3 24.81,11.49 C3.2 27.05,9.72 | 27.18,8.91 32.16,8.91 C29.+ | U8.3 14.39,11.18 14.38,11.18 14.63,11.43 C32.2 19.47,8.91 27.18,8.91 | 27.05,9.72 27.05,9.05 27.18,8.91 | 27.05,9.72 27.05,9.37 26.7,9.02 | 27.05,9.72 27.05,9.43 27.46,9.02
N$14
  Top 0.254: R31.2 41.43,6.6 41.81,6.22 43.97,4.06 49.28,4.06 U9.17
N$15
  Top 0.254: U2.42 29.37,32.76 R4.1
N$16
  Top 0.254: U3.2 49.97,29.88 R26.2
N$17
  Top 0.254: U7.2 45.34,12.67 44.99,12.32 44.99,10.67 45.5,10.16 R29.1
  pour Top (no thermals): 2.34,41.91 2.84,42.37 2.84,41.45
  pour Top (no thermals): 1.68,41.91 2.19,42.37 2.19,41.45
N$18
  Top 0.254: U3.5 50.21,27.93 R27.2
N$19
  Top 0.254: R30.1 43.97,14.1 44.48,14.61 46.09,14.61 U7.5
N$20
  Top 0.254: U7.12 42.05,13.32 42.38,12.99 42.38,11.11 R31.1
N$21
  Top 0.254: U3.3 53.86,29.23 54.39,28.7 54.39,17.73 53.93,17.27 U5.2
N$22
  Top 0.254: R29.2 46.51,7.19 46.89,6.81 47.99,5.71 55.24,5.71 55.25,5.71 U9.20
N$23
  Top 0.254: 53.09,5.21 46.75,5.21 46,5.21 43.97,7.24 R30.2 | 53.09,5.21 53.21,5.21 | 53.09,5.21 53.22,5.21 U9.19
  pour Top (no thermals): 6.71,42.37 6.71,41.45 7.21,41.91
N$24
  Top 0.254: U7.8 41.97,15.97 42.96,14.99 42.96,6.99 45.25,4.7 51.18,4.7 51.19,4.7 U9.18
N$25
  pour Top (no thermals): 3.89,42.37 4.42,41.91 3.89,41.45
N$26  (via drill 0.3 pad 0.64)
  Top 0.254: R27.1 v49.94,25.4
  Bottom 0.305: v49.94,25.4 60.99,25.4 62.26,26.67 64.65,26.67 | 64.77,26.67 64.65,26.67 | 64.65,26.67 64.77,26.67 U9.32
N$27
  pour Top (no thermals): 6.71,42.37 7.21,41.91 6.71,41.45
N$28
  pour Top (no thermals): 6.05,42.37 6.05,41.45 6.55,41.91
N$29
  Top 0.152: 5.05,42.37 5.05,41.45
N$30
  Top 0.152: 3.81,43.94 3.49,43.94 3.49,44.45 3.81,44.45 | 3.81,43.94 3.81,44.45 | 3.81,44.45 4.32,44.83 arc-19 4.32,43.56 3.81,43.94
N$31
  Top 0.152: 4.7,44.2 5.33,44.2
N$32
  Top 0.152: 5.02,44.51 5.02,43.88
N$33
  Top 0.406: R28.1 62.49,27.05 | 62.49,27.05 62.61,27.05 | 62.49,27.05 62.62,27.05 U9.35
N$34
  Top 0.152: 3.81,39.37 3.49,39.37 3.49,39.88 3.81,39.88 | 3.81,39.37 3.81,39.88 | 3.81,39.88 4.32,40.26 arc-19 4.32,38.99 3.81,39.37
N$35
  Top 0.152: 4.7,39.62 5.33,39.62
N$36
  Top 0.406: R20.2 63.25,30.35 | 63.25,30.35 63.37,30.35 | 63.25,30.35 arc60 U9.36
N$37
  Top 0.254: D1.+ R13.1
N$38
  Top 0.254: U7.9 38.73,15.27 38.03,15.97 R25.1
N$39
  Top 0.406: U3.11 58.99,28.57 R23.2 R20.1
N$40
  Top 0.406: U3.9 58.99,27.27 R28.2
N$41
  Top 0.152: 1.4,42.37 1.4,41.45
  pour Top (isolate 0.254, no thermals): 2.19,42.37 2.19,41.45 1.68,41.91
N$42
  pour Top (isolate 0.254, no thermals): 2.34,41.91 2.84,42.37 2.84,41.45 2.34,41.91
N$43
  Top 0.152: 4.75,42.37 4.75,41.45
N$44
  pour Top: 1.68,41.92 2.19,42.37 2.19,41.45 1.68,41.91
N$45
  Top 0.152: 7.5,42.37 7.5,41.45
PULL_UP1
  Top 0.406: GPIO1.11 45.34,19.3 R14.1
PULL_UP2
  Top 0.406: GPIO2.11 40.89,19.68 R16.1
PULL_UP3
  Top 0.406: GPIO3.11 36.45,20.19 R18.1
RIGHT
  Top 0.406: J2.7 6.7,34.24 arc-90 7.62,35.16 D4.2 14.9,35.18 R21.2 18.42,35.18 18.47,35.13 C2.-
  Top 0.61: J2.7 6.7,30.02 arc45 6.89,29.57 8.41,28.04 arc-45 8.6,27.59 J2.3
SCK  (via drill 0.3 pad 0.64)
  Top 0.254: U2.28 36.05,37.67 40.03,41.66 49.05,41.66 50.58,40.13 50.58,35.43 49.69,34.54 v49.69,34.16 | U3.8 55.94,26.57 v55.91,26.54 55.91,8.29 54.6,6.99 49.69,6.99 48.42,8.26 48.42,13.34 49.05,13.97 U5.5
  Bottom 0.254: v49.69,34.16 55.76,28.09 55.76,26.67 55.88,26.54 v55.91,26.54
VOLUME
  Top 0.305: U9.9 40.14,49.28 19.82,49.28 18.17,47.62 11.94,47.62 10.93,48.64 R13.2
VS_DREQ
  Top 0.254: U2.8 35.55,26.97 37.49,25.02 37.49,23.62 34.45,20.57 34.45,14.73 34.7,14.48 34.83,14.35 R24.2 R25.2
VS_XCS  (via drill 0.3 pad 0.64)
  Top 0.254: U2.23 40.1,34.76 41.66,36.32 46.64,36.32 47.4,35.56 47.4,27.69 47.15,27.43 v47.12,27.43 | U7.3 47.27,13.32 | 47.27,13.32 47.39,13.32 47.4,13.34 | v47.37,13.34 47.29,13.34 47.27,13.32
  Bottom 0.254: v47.12,27.43 48.26,26.29 48.26,14.22 v47.37,13.34
VS_XDCS  (via drill 0.3 pad 0.64)
  Top 0.254: U2.13 39.48,29.76 39.91,29.34 39.91,27.56 40.54,26.92 45.5,26.92 v45.88,27.3 | U7.6 47.3,15.27 v47.4,15.37
  Bottom 0.254: v47.4,15.37 47.4,25.78 v45.88,27.3
VS_XRESET
  Top 0.254: U7.11 39.37,13.97 R1.1 38.1,12.73 37.3,13.53 34.64,13.53 33.94,14.22 33.94,19.71 30.74,22.91 30.74,25.43 31.85,26.54 32.41,26.54 33.05,27.18 U2.3
(copper drawn outside any net)
  shapes: Top circle x1

### Text on the board
tPlace: J3 | J4 | AREF | LROUT | DIGITAL | MCLK | SCLK | I2S | DATA | MIDI | GND | ISP | H | L | H | L | H | L | POWER | J5 | J6
bPlace: Music Shield | v2.0 08/06/2012 | by Seeed Studio | www.seeedstudio.com